# EAGLE schematic DIPESH-1 (EAGLE 9.6.2)
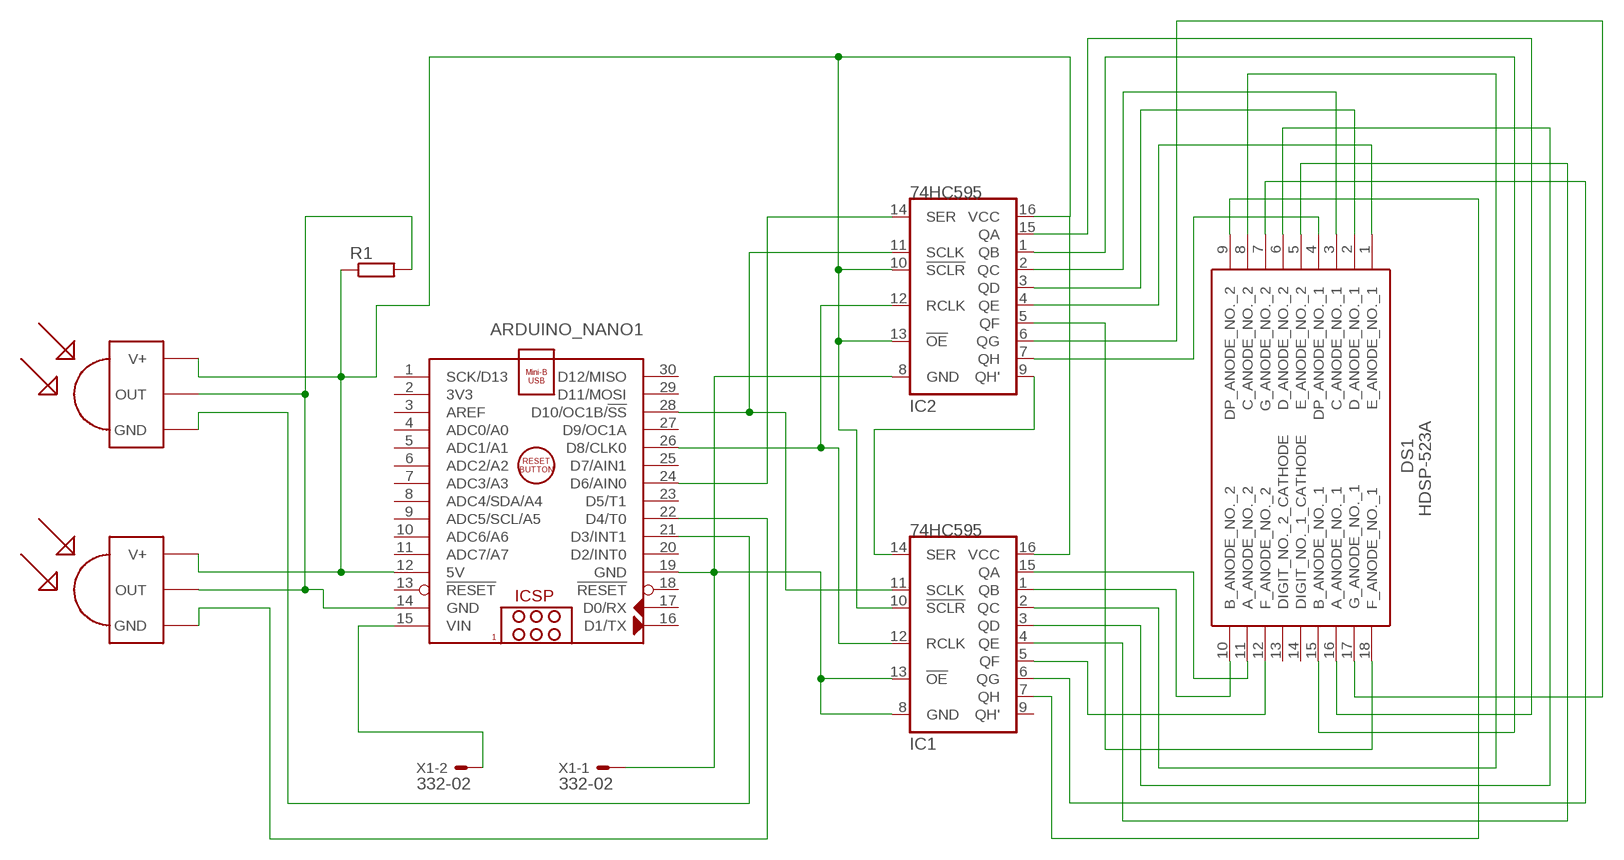
[diagram p0: schematic, sheet 1]

## Parts
ARDUINO_NANO1  ARDUINO_NANO  [ARDUINO_NANO]
DS1  HDSP-523A  [DIPS1524W50P254L2500H800Q18N]
IC1  74HC595  [SO16]
IC2  74HC595  [SO16]
R1  R-EU_0207/10  [0207/10]
TSOP1  TSOP1730  [TSOP17XX]
TSOP2  TSOP1730  [TSOP17XX]
X1  332-02  [332-02]

## Nets
N$1: ARDUINO_NANO1.19(GND) IC1.8(GND) IC1.13(!OE) IC2.8(GND) X1.1
N$2: ARDUINO_NANO1.21(D3/INT1) TSOP1.GND
N$3: ARDUINO_NANO1.22(D4/T0) TSOP2.GND
N$4: IC1.14(SER) IC2.9(QH')
N$5: ARDUINO_NANO1.15(VIN) X1.2
N$6: ARDUINO_NANO1.12(5V) IC1.10(!SCLR) IC1.16(VCC) IC2.10(!SCLR) IC2.13(!OE) IC2.16(VCC) R1.1 TSOP1.V+ TSOP2.V+
N$7: ARDUINO_NANO1.14(GND) R1.2 TSOP1.OUT TSOP2.OUT
N$8: DS1.11(A_ANODE_NO._2) IC1.15(QA)
N$9: ARDUINO_NANO1.24(D6/AIN0) IC2.14(SER)
N$10: DS1.16(A_ANODE_NO._1) IC2.15(QA)
N$11: ARDUINO_NANO1.26(D8/CLK0) IC1.12(RCLK) IC2.12(RCLK)
N$12: ARDUINO_NANO1.28(D10/OC1B/!SS) IC1.11(SCLK) IC2.11(SCLK)
N$13: DS1.15(B_ANODE_NO._1) IC2.1(QB)
N$14: DS1.5(E_ANODE_NO._2) IC1.4(QE)
N$15: DS1.10(B_ANODE_NO._2) IC1.1(QB)
N$16: DS1.8(C_ANODE_NO._2) IC1.2(QC)
N$17: DS1.3(C_ANODE_NO._1) IC2.2(QC)
N$18: DS1.2(D_ANODE_NO._1) IC2.3(QD)
N$19: DS1.6(D_ANODE_NO._2) IC1.3(QD)
N$20: DS1.1(E_ANODE_NO._1) IC2.4(QE)
N$21: DS1.18(F_ANODE_NO._1) IC2.5(QF)
N$22: DS1.12(F_ANODE_NO._2) IC1.5(QF)
N$23: DS1.7(G_ANODE_NO._2) IC1.6(QG)
N$24: DS1.17(G_ANODE_NO._1) IC2.6(QG)
N$25: DS1.9(DP_ANODE_NO._2) IC1.7(QH)
N$26: DS1.4(DP_ANODE_NO._1) IC2.7(QH)
Unconnected: ARDUINO_NANO1.1(SCK/D13) ARDUINO_NANO1.2(3V3) ARDUINO_NANO1.3(AREF) ARDUINO_NANO1.4(ADC0/A0) ARDUINO_NANO1.5(ADC1/A1) ARDUINO_NANO1.6(ADC2/A2) ARDUINO_NANO1.7(ADC3/A3) ARDUINO_NANO1.8(ADC4/SDA/A4) ARDUINO_NANO1.9(ADC5/SCL/A5) ARDUINO_NANO1.10(ADC6/A6) ARDUINO_NANO1.11(ADC7/A7) ARDUINO_NANO1.13(!RESET) ARDUINO_NANO1.16(D1/TX) ARDUINO_NANO1.17(D0/RX) ARDUINO_NANO1.18(!RESET) ARDUINO_NANO1.20(D2/INT0) ARDUINO_NANO1.23(D5/T1) ARDUINO_NANO1.25(D7/AIN1) ARDUINO_NANO1.27(D9/OC1A) ARDUINO_NANO1.29(D11/MOSI) ARDUINO_NANO1.30(D12/MISO) DS1.13(DIGIT_NO._2_CATHODE) DS1.14(DIGIT_NO._1_CATHODE) IC1.9(QH')

## Library data of the parts
ARDUINO_NANO1 = ArduinoNanoV30:ARDUINO_NANO: Arduino Nano V3.0 Module Overview: The Arduino Nano is a small, complete, and breadboard-friendly board based on the ATmega328 (Arduino Nano 3.x) or ATmega168 (Arduino Nano 2.x). It has more or less the same functionality of the Arduino Duemilanove, but in a different package. It lacks only a DC power jack, and works with a Mini-B USB cable instead of a standard one. The Nano was designed and is being produced by Gravitech <http://www.gravitech.us/arna30wiatp.html>. General specifications: Item Value Microcontroller Atmel ATmega168 or ATmega328 Operating Voltage (logic level) 5 V Input Voltage (recommended) 7-12 V Input Voltage (limits) 6-20 V Digital I/O Pins 14 (of which 6 provide PWM output) Analog Input Pins 8 DC Current per I/O Pin 40 mA Flash Memory 16 KB (ATmega168) or 32 KB (ATmega328) of which 2 KB used by bootloader SRAM 1 KB (ATmega168) or 2 KB (ATmega328) EEPROM 512 bytes (ATmega168) or 1 KB (ATmega328) Clock Speed 16 MHz Dimensions (Inches) 0.73" x 1.70" Dimensions (mm) 18mm x 45mm Overall height About 9 mm (not including pins) Weigth 5 g Power: The Arduino Nano can be powered via the Mini-B USB connection, 6-20V unregulated external power supply (pin 30), or 5V regulated external power supply (pin 27). The power source is automatically selected to the highest voltage source. Memory: The ATmega168 has 16 KB of flash memory for storing code (of which 2 KB is used for the bootloader); the ATmega328 has 32 KB, (also with 2 KB used for the bootloader). The ATmega168 has 1 KB of SRAM and 512 bytes of EEPROM (which can be read and written with the EEPROM library); the ATmega328 has 2 KB of SRAM and 1 KB of EEPROM. Input and Output: Each of the 14 digital pins on the Nano can be used as an input or output, using pinMode(), digitalWrite(), and digitalRead() functions. They operate at 5 volts. Each pin can provide or receive a maximum of 40 mA and has an internal pull-up resistor (disconnected by default) of 20-50 kOhms. In addition, some pins have specialized functions. Visit Arduino - ArduinoBoardNano <https://www.arduino.cc/en/Main/ArduinoBoardNano>
DS1 = HDSP-523A:HDSP-523A: LED Displays & Accessories Red 643nm 0.56in 7 Segment Source: Datasheet <https://docs.broadcom.com/doc/HDSP-521A-523A-Dual-Digit-General-Purpose-7-Segment-Display-DS>; DESCRIPTION: LED Displays & Accessories Red 643nm 0.56in 7 Segment; HEIGHT: 8mm; MANUFACTURER_NAME: Avago Technologies; MANUFACTURER_PART_NUMBER: HDSP-523A; MOUSER_PART_NUMBER: 630-HDSP-523A; MOUSER_PRICE-STOCK: https://www.mouser.co.uk/ProductDetail/Broadcom-Avago/HDSP-523A?qs=pQfy5%252BKCabJDIZsniRXu3w%3D%3D
IC1 IC2 = 74HC595:74HC595: 8-bit SHIFT REGISTER, output latch Check availability <https://pricing.snapeda.com/parts/74HC595/Nexperia/view-part?ref=eda>; AVAILABILITY: In Stock; DESCRIPTION: Shift Register Single 8-Bit Serial to Serial/Parallel 16-Pin SSOP T/R; MF: Nexperia; MP: 74HC595; PACKAGE: None; PRICE: None; PURCHASE-URL: https://pricing.snapeda.com/search/part/74HC595/?ref=eda
R1 = rcl:R-EU_: RESISTOR, European symbol; SPICEPREFIX: R
TSOP1 TSOP2 = tsop:TSOP1730: IR Receiver and Demodulator
X1 = con-garry:332-02: 2 Pin - 2mm Dual Row Source: www.mpe-connector.de / garry_shortform_2012.pdf